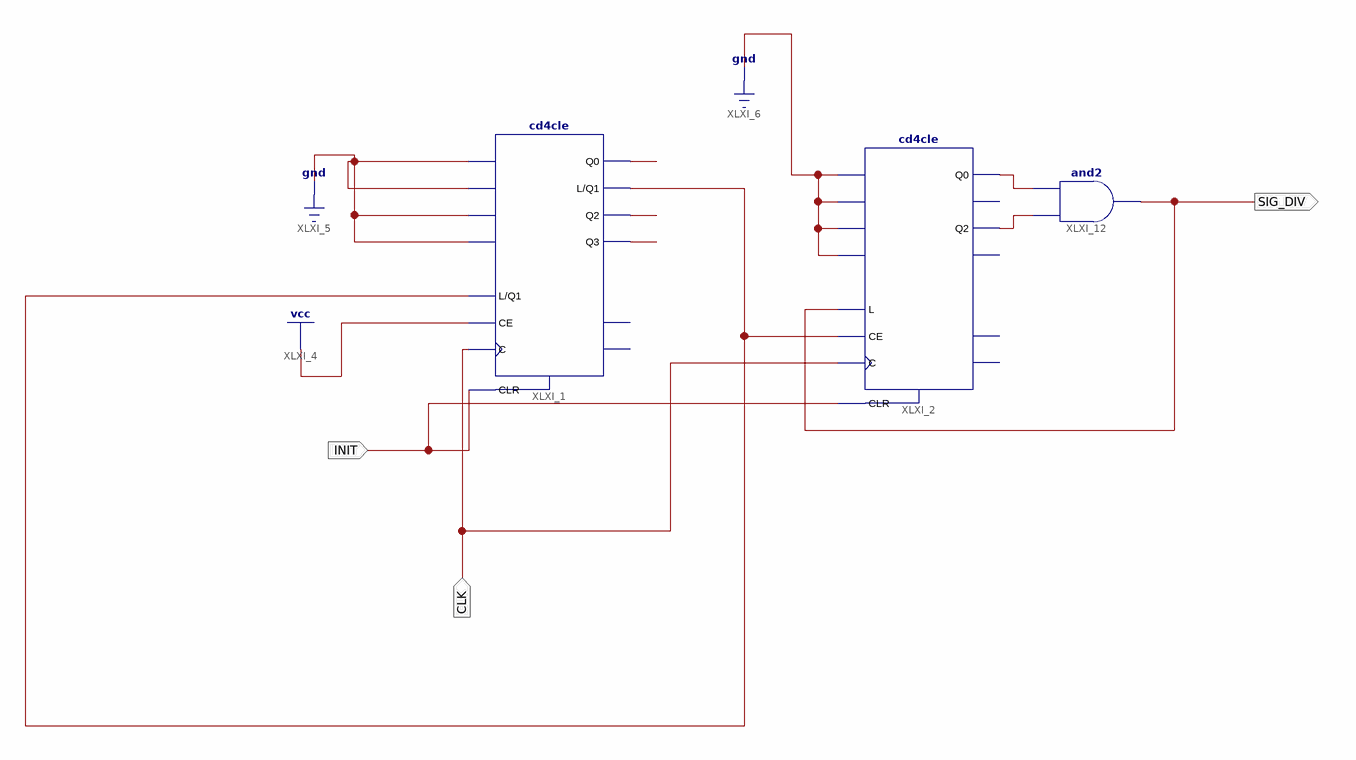
[diagram p0: schematic sheet 1]
// Xilinx ISE schematic p3ej3.sch (artix7) as structural Verilog: 3 symbols, 3 ports
module p3ej3 (
  input  INIT,
  input  CLK,
  output SIG_DIV
);

  wire XLXN_9, XLXN_10, XLXN_11, XLXN_12, XLXN_46, XLXN_47;

  cd4cle XLXI_1 (
    .C(CLK), .CE(1'b1), .CLR(INIT), .D0(1'b0), .D1(1'b0), .D2(1'b0), .D3(1'b0), .L(XLXN_10), .Q0(XLXN_9),
    .Q1(XLXN_10), .Q2(XLXN_11), .Q3(XLXN_12));  // open: CEO, TC
  cd4cle XLXI_2 (
    .C(CLK), .CE(XLXN_10), .CLR(INIT), .D0(1'b0), .D1(1'b0), .D2(1'b0), .D3(1'b0), .L(SIG_DIV), .Q0(XLXN_46),
    .Q2(XLXN_47));  // open: CEO, Q1, Q3, TC
  and XLXI_12 (SIG_DIV, XLXN_47, XLXN_46);
endmodule
